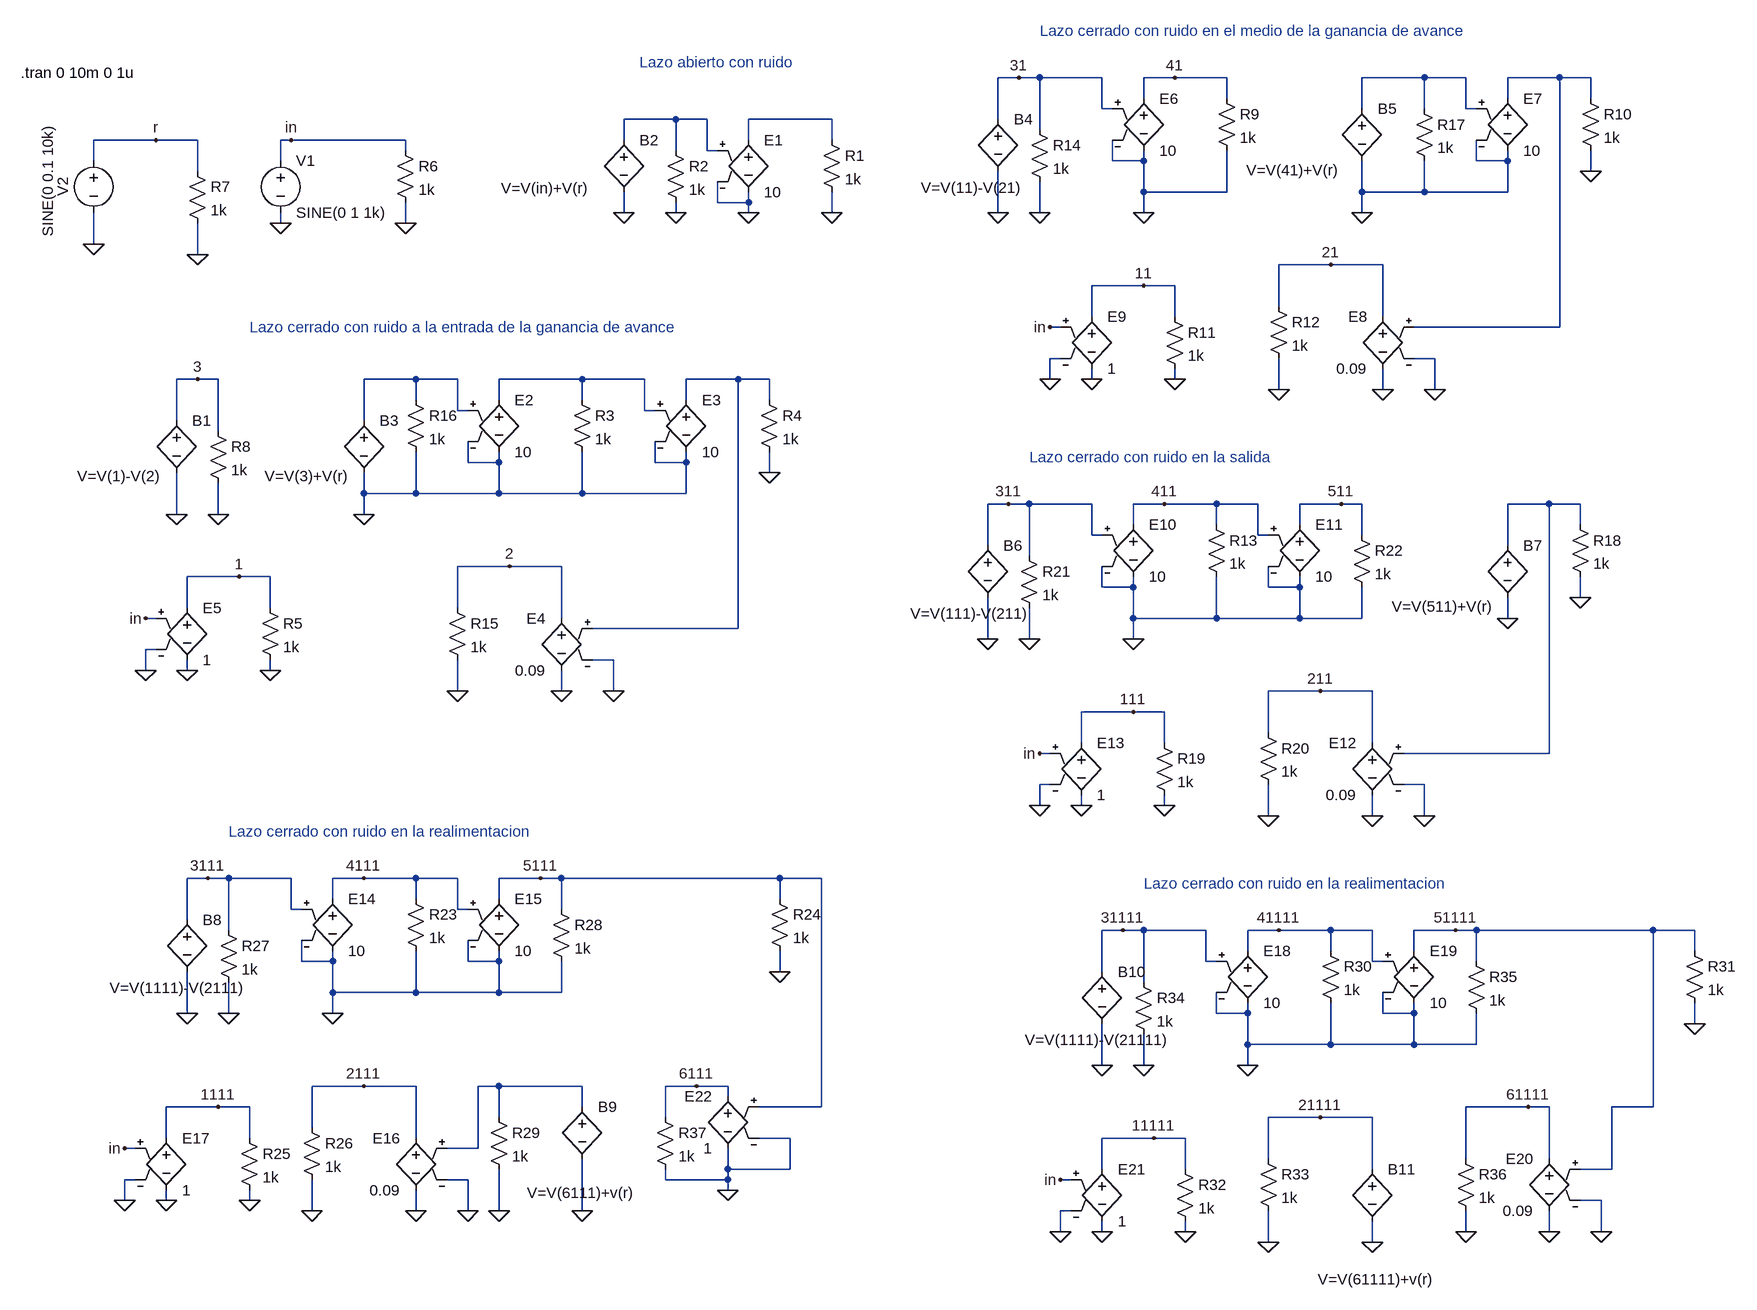
[diagram p0: schematic perturbaciones2.asc]
perturbaciones2.asc, the LTspice schematic file:
Version 4
SHEET 1 2744 1748
WIRE 720 -320 688 -320
WIRE 752 -320 720 -320
WIRE 848 -320 752 -320
WIRE 960 -320 912 -320
WIRE 1040 -320 960 -320
WIRE 1344 -320 1248 -320
WIRE 1408 -320 1344 -320
WIRE 1552 -320 1472 -320
WIRE 1600 -320 1552 -320
WIRE 912 -288 912 -320
WIRE 1040 -288 1040 -320
WIRE 1472 -288 1472 -320
WIRE 1600 -288 1600 -320
WIRE 848 -272 848 -320
WIRE 864 -272 848 -272
WIRE 1248 -272 1248 -320
WIRE 1344 -272 1344 -320
WIRE 1408 -272 1408 -320
WIRE 1424 -272 1408 -272
WIRE 192 -256 112 -256
WIRE 240 -256 192 -256
WIRE 432 -256 304 -256
WIRE 688 -256 688 -320
WIRE 752 -240 752 -320
WIRE -608 -224 -704 -224
WIRE -544 -224 -608 -224
WIRE -400 -224 -416 -224
WIRE -224 -224 -400 -224
WIRE 112 -224 112 -256
WIRE 304 -224 304 -256
WIRE 432 -224 432 -256
WIRE -224 -208 -224 -224
WIRE 192 -208 192 -256
WIRE 240 -208 240 -256
WIRE 256 -208 240 -208
WIRE -704 -192 -704 -224
WIRE -416 -192 -416 -224
WIRE 864 -192 864 -224
WIRE 912 -192 912 -208
WIRE 912 -192 864 -192
WIRE 1424 -192 1424 -224
WIRE 1472 -192 1472 -208
WIRE 1472 -192 1424 -192
WIRE -544 -176 -544 -224
WIRE 1600 -176 1600 -208
WIRE 912 -144 912 -192
WIRE 1040 -144 1040 -208
WIRE 1040 -144 912 -144
WIRE 1248 -144 1248 -192
WIRE 1344 -144 1344 -192
WIRE 1344 -144 1248 -144
WIRE 1472 -144 1472 -192
WIRE 1472 -144 1344 -144
WIRE 256 -128 256 -160
WIRE 304 -128 304 -144
WIRE 304 -128 256 -128
WIRE 112 -112 112 -144
WIRE 192 -112 192 -128
WIRE 304 -112 304 -128
WIRE 432 -112 432 -144
WIRE 688 -112 688 -176
WIRE 752 -112 752 -160
WIRE 912 -112 912 -144
WIRE 1248 -112 1248 -144
WIRE -416 -96 -416 -112
WIRE -224 -96 -224 -128
WIRE -704 -64 -704 -112
WIRE -544 -48 -544 -96
WIRE 1200 -32 1120 -32
WIRE 1280 -32 1200 -32
WIRE 912 0 832 0
WIRE 960 0 912 0
WIRE 1120 32 1120 -32
WIRE 832 48 832 0
WIRE 960 48 960 0
WIRE 1280 48 1280 -32
WIRE 784 64 768 64
WIRE 1552 64 1552 -320
WIRE 1552 64 1328 64
WIRE 784 112 768 112
WIRE 1360 112 1328 112
WIRE -544 144 -576 144
WIRE -512 144 -544 144
WIRE -208 144 -288 144
WIRE -144 144 -208 144
WIRE 48 144 -80 144
WIRE 144 144 48 144
WIRE 288 144 208 144
WIRE 336 144 288 144
WIRE 768 144 768 112
WIRE 832 144 832 128
WIRE 960 144 960 128
WIRE 1120 160 1120 112
WIRE 1280 160 1280 128
WIRE 1360 160 1360 112
WIRE -208 176 -208 144
WIRE -80 176 -80 144
WIRE 48 176 48 144
WIRE 208 176 208 144
WIRE 336 176 336 144
WIRE -144 192 -144 144
WIRE -128 192 -144 192
WIRE 144 192 144 144
WIRE 160 192 144 192
WIRE -576 208 -576 144
WIRE -288 208 -288 144
WIRE -512 224 -512 144
WIRE -128 272 -128 240
WIRE -80 272 -80 256
WIRE -80 272 -128 272
WIRE 160 272 160 240
WIRE 208 272 208 256
WIRE 208 272 160 272
WIRE 336 288 336 256
WIRE -288 320 -288 288
WIRE -208 320 -208 256
WIRE -208 320 -288 320
WIRE -80 320 -80 272
WIRE -80 320 -208 320
WIRE 48 320 48 256
WIRE 48 320 -80 320
WIRE 208 320 208 272
WIRE 208 320 48 320
WIRE 704 336 672 336
WIRE 736 336 704 336
WIRE 832 336 736 336
WIRE 944 336 896 336
WIRE 1024 336 944 336
WIRE 1088 336 1024 336
WIRE 1216 336 1152 336
WIRE 1248 336 1216 336
WIRE 1536 336 1472 336
WIRE 1584 336 1536 336
WIRE -576 352 -576 288
WIRE -512 352 -512 304
WIRE -288 352 -288 320
WIRE 896 368 896 336
WIRE 1024 368 1024 336
WIRE 1152 368 1152 336
WIRE 1584 368 1584 336
WIRE 832 384 832 336
WIRE 848 384 832 384
WIRE 1088 384 1088 336
WIRE 1104 384 1088 384
WIRE 1248 384 1248 336
WIRE 672 400 672 336
WIRE 1472 400 1472 336
WIRE 736 416 736 336
WIRE -64 432 -144 432
WIRE 16 432 -64 432
WIRE -480 448 -560 448
WIRE -432 448 -480 448
WIRE 848 464 848 432
WIRE 896 464 896 448
WIRE 896 464 848 464
WIRE 1104 464 1104 432
WIRE 1152 464 1152 448
WIRE 1152 464 1104 464
WIRE 1584 480 1584 448
WIRE -560 496 -560 448
WIRE -432 496 -432 448
WIRE -144 496 -144 432
WIRE -608 512 -624 512
WIRE 16 512 16 432
WIRE 896 512 896 464
WIRE 1024 512 1024 448
WIRE 1024 512 896 512
WIRE 1152 512 1152 464
WIRE 1152 512 1024 512
WIRE 1248 512 1248 464
WIRE 1248 512 1152 512
WIRE 1472 512 1472 480
WIRE 288 528 288 144
WIRE 288 528 64 528
WIRE 672 544 672 480
WIRE 736 544 736 496
WIRE 896 544 896 512
WIRE -608 560 -624 560
WIRE 96 576 64 576
WIRE -624 592 -624 560
WIRE -560 592 -560 576
WIRE -432 592 -432 576
WIRE -144 624 -144 576
WIRE 16 624 16 592
WIRE 96 624 96 576
WIRE 1184 624 1104 624
WIRE 1264 624 1184 624
WIRE 896 656 816 656
WIRE 944 656 896 656
WIRE 1104 688 1104 624
WIRE 816 704 816 656
WIRE 944 704 944 656
WIRE 1264 704 1264 624
WIRE 768 720 752 720
WIRE 1536 720 1536 336
WIRE 1536 720 1312 720
WIRE 768 768 752 768
WIRE 1344 768 1312 768
WIRE 752 800 752 768
WIRE 816 800 816 784
WIRE 944 800 944 784
WIRE 1104 816 1104 768
WIRE 1264 816 1264 784
WIRE 1344 816 1344 768
WIRE -528 912 -560 912
WIRE -496 912 -528 912
WIRE -400 912 -496 912
WIRE -288 912 -336 912
WIRE -208 912 -288 912
WIRE -144 912 -208 912
WIRE -16 912 -80 912
WIRE 16 912 -16 912
WIRE 352 912 16 912
WIRE 416 912 352 912
WIRE -336 944 -336 912
WIRE -208 944 -208 912
WIRE -80 944 -80 912
WIRE 352 944 352 912
WIRE -400 960 -400 912
WIRE -384 960 -400 960
WIRE -144 960 -144 912
WIRE -128 960 -144 960
WIRE 16 960 16 912
WIRE -560 976 -560 912
WIRE -496 992 -496 912
WIRE 880 992 848 992
WIRE 912 992 880 992
WIRE 1008 992 912 992
WIRE 1120 992 1072 992
WIRE 1200 992 1120 992
WIRE 1264 992 1200 992
WIRE 1392 992 1328 992
WIRE 1424 992 1392 992
WIRE 1696 992 1424 992
WIRE 1760 992 1696 992
WIRE 1072 1024 1072 992
WIRE 1200 1024 1200 992
WIRE 1328 1024 1328 992
WIRE 1760 1024 1760 992
WIRE -384 1040 -384 1008
WIRE -336 1040 -336 1024
WIRE -336 1040 -384 1040
WIRE -128 1040 -128 1008
WIRE -80 1040 -80 1024
WIRE -80 1040 -128 1040
WIRE 1008 1040 1008 992
WIRE 1024 1040 1008 1040
WIRE 1264 1040 1264 992
WIRE 1280 1040 1264 1040
WIRE 1424 1040 1424 992
WIRE 352 1056 352 1024
WIRE 848 1056 848 992
WIRE 912 1072 912 992
WIRE -336 1088 -336 1040
WIRE -208 1088 -208 1024
WIRE -208 1088 -336 1088
WIRE -80 1088 -80 1040
WIRE -80 1088 -208 1088
WIRE 16 1088 16 1040
WIRE 16 1088 -80 1088
WIRE -560 1120 -560 1056
WIRE -496 1120 -496 1072
WIRE -336 1120 -336 1088
WIRE 1024 1120 1024 1088
WIRE 1072 1120 1072 1104
WIRE 1072 1120 1024 1120
WIRE 1280 1120 1280 1088
WIRE 1328 1120 1328 1104
WIRE 1328 1120 1280 1120
WIRE 1760 1136 1760 1104
WIRE 1072 1168 1072 1120
WIRE 1200 1168 1200 1104
WIRE 1200 1168 1072 1168
WIRE 1328 1168 1328 1120
WIRE 1328 1168 1200 1168
WIRE 1424 1168 1424 1120
WIRE 1424 1168 1328 1168
WIRE 848 1200 848 1136
WIRE 912 1200 912 1152
WIRE 1072 1200 1072 1168
WIRE -288 1232 -368 1232
WIRE -208 1232 -288 1232
WIRE -80 1232 -112 1232
WIRE 48 1232 -80 1232
WIRE 224 1232 176 1232
WIRE 272 1232 224 1232
WIRE 272 1248 272 1232
WIRE -512 1264 -592 1264
WIRE -464 1264 -512 1264
WIRE 48 1264 48 1232
WIRE 416 1264 416 912
WIRE 416 1264 320 1264
WIRE 1504 1264 1408 1264
WIRE 1536 1264 1504 1264
WIRE 1696 1264 1696 992
WIRE 1696 1264 1632 1264
WIRE -80 1280 -80 1232
WIRE 176 1280 176 1232
WIRE 1184 1280 1104 1280
WIRE 1264 1280 1184 1280
WIRE -368 1296 -368 1232
WIRE -592 1312 -592 1264
WIRE -464 1312 -464 1264
WIRE -208 1312 -208 1232
WIRE 368 1312 320 1312
WIRE 928 1312 848 1312
WIRE 976 1312 928 1312
WIRE -640 1328 -656 1328
WIRE -112 1328 -112 1232
WIRE -112 1328 -160 1328
WIRE 1104 1344 1104 1280
WIRE 1408 1344 1408 1264
WIRE 1536 1344 1536 1264
WIRE 272 1360 272 1328
WIRE 368 1360 368 1312
WIRE 368 1360 272 1360
WIRE 848 1360 848 1312
WIRE 976 1360 976 1312
WIRE 1264 1360 1264 1280
WIRE 1632 1360 1632 1264
WIRE 1632 1360 1584 1360
WIRE -640 1376 -656 1376
WIRE -128 1376 -160 1376
WIRE 176 1376 176 1360
WIRE 272 1376 272 1360
WIRE 272 1376 176 1376
WIRE 800 1376 784 1376
WIRE 272 1392 272 1376
WIRE -656 1408 -656 1376
WIRE -592 1408 -592 1392
WIRE -464 1408 -464 1392
WIRE 1616 1408 1584 1408
WIRE -368 1424 -368 1376
WIRE -208 1424 -208 1392
WIRE -128 1424 -128 1376
WIRE -80 1424 -80 1360
WIRE 48 1424 48 1344
WIRE 800 1424 784 1424
WIRE 784 1456 784 1424
WIRE 848 1456 848 1440
WIRE 976 1456 976 1440
WIRE 1408 1456 1408 1424
WIRE 1536 1456 1536 1424
WIRE 1616 1456 1616 1408
WIRE 1104 1472 1104 1424
WIRE 1264 1472 1264 1440
FLAG 304 -112 0
FLAG 432 -112 0
FLAG -416 -96 0
FLAG 192 -112 0
FLAG 336 288 0
FLAG 16 624 0
FLAG 96 624 0
FLAG -400 -224 in
FLAG -560 592 0
FLAG -624 592 0
FLAG -624 512 in
FLAG -432 592 0
FLAG -480 448 1
FLAG -64 432 2
FLAG -144 624 0
FLAG -576 352 0
FLAG -224 -96 0
FLAG -704 -64 0
FLAG -544 -48 0
FLAG -608 -224 r
FLAG 112 -112 0
FLAG -512 352 0
FLAG -544 144 3
FLAG -288 352 0
FLAG 1600 -176 0
FLAG 1280 160 0
FLAG 1360 160 0
FLAG 832 144 0
FLAG 768 144 0
FLAG 768 64 in
FLAG 960 144 0
FLAG 912 0 11
FLAG 1200 -32 21
FLAG 1120 160 0
FLAG 688 -112 0
FLAG 752 -112 0
FLAG 720 -320 31
FLAG 912 -112 0
FLAG 1248 -112 0
FLAG 960 -320 41
FLAG 1584 480 0
FLAG 1264 816 0
FLAG 1344 816 0
FLAG 816 800 0
FLAG 752 800 0
FLAG 752 720 in
FLAG 944 800 0
FLAG 896 656 111
FLAG 1184 624 211
FLAG 1104 816 0
FLAG 672 544 0
FLAG 736 544 0
FLAG 704 336 311
FLAG 896 544 0
FLAG 944 336 411
FLAG 1216 336 511
FLAG 1472 512 0
FLAG 352 1056 0
FLAG -208 1424 0
FLAG -128 1424 0
FLAG -592 1408 0
FLAG -656 1408 0
FLAG -656 1328 in
FLAG -464 1408 0
FLAG -512 1264 1111
FLAG -288 1232 2111
FLAG -368 1424 0
FLAG -560 1120 0
FLAG -496 1120 0
FLAG -528 912 3111
FLAG -336 1120 0
FLAG -288 912 4111
FLAG -16 912 5111
FLAG -80 1424 0
FLAG 48 1424 0
FLAG 1760 1136 0
FLAG 1536 1456 0
FLAG 1616 1456 0
FLAG 848 1456 0
FLAG 784 1456 0
FLAG 784 1376 in
FLAG 976 1456 0
FLAG 928 1312 11111
FLAG 1184 1280 21111
FLAG 1104 1472 0
FLAG 848 1200 0
FLAG 912 1200 0
FLAG 880 992 31111
FLAG 1072 1200 0
FLAG 1120 992 41111
FLAG 1392 992 51111
FLAG 1264 1472 0
FLAG 1408 1456 0
FLAG 1504 1264 61111
FLAG 272 1392 0
FLAG 224 1232 6111
SYMBOL e 304 -240 R0
SYMATTR InstName E1
SYMATTR Value 10
SYMBOL res 416 -240 R0
SYMATTR InstName R1
SYMATTR Value 1k
SYMBOL voltage -416 -208 R0
WINDOW 123 0 0 Left 0
WINDOW 39 0 0 Left 0
SYMATTR InstName V1
SYMATTR Value SINE(0 1 1k)
SYMBOL voltage -704 -208 R0
WINDOW 0 -32 56 VBottom 2
WINDOW 3 -86 47 VTop 2
WINDOW 123 0 0 Left 0
WINDOW 39 0 0 Left 0
SYMATTR InstName V2
SYMATTR Value SINE(0 0.1 10k)
SYMBOL res 176 -224 R0
SYMATTR InstName R2
SYMATTR Value 1k
SYMBOL e -80 160 R0
SYMATTR InstName E2
SYMATTR Value 10
SYMBOL res 32 160 R0
SYMATTR InstName R3
SYMATTR Value 1k
SYMBOL e 208 160 R0
SYMATTR InstName E3
SYMATTR Value 10
SYMBOL res 320 160 R0
SYMATTR InstName R4
SYMATTR Value 1k
SYMBOL e 16 496 M0
SYMATTR InstName E4
SYMATTR Value 0.09
SYMBOL e -560 480 R0
SYMATTR InstName E5
SYMATTR Value 1
SYMBOL res -448 480 R0
SYMATTR InstName R5
SYMATTR Value 1k
SYMBOL bv -576 192 R0
WINDOW 3 -153 101 Left 2
SYMATTR InstName B1
SYMATTR Value V=V(1)-V(2)
SYMBOL res -160 480 R0
SYMATTR InstName R15
SYMATTR Value 1k
SYMBOL res -224 160 R0
SYMATTR InstName R16
SYMATTR Value 1k
SYMBOL res -240 -224 R0
SYMATTR InstName R6
SYMATTR Value 1k
SYMBOL bv 112 -240 R0
WINDOW 3 -189 90 Left 2
SYMATTR InstName B2
SYMATTR Value V=V(in)+V(r)
SYMBOL res -560 -192 R0
SYMATTR InstName R7
SYMATTR Value 1k
SYMBOL bv -288 192 R0
WINDOW 3 -153 101 Left 2
SYMATTR InstName B3
SYMATTR Value V=V(3)+V(r)
SYMBOL res -528 208 R0
SYMATTR InstName R8
SYMATTR Value 1k
SYMBOL e 912 -304 R0
SYMATTR InstName E6
SYMATTR Value 10
SYMBOL res 1024 -304 R0
SYMATTR InstName R9
SYMATTR Value 1k
SYMBOL e 1472 -304 R0
SYMATTR InstName E7
SYMATTR Value 10
SYMBOL res 1584 -304 R0
SYMATTR InstName R10
SYMATTR Value 1k
SYMBOL e 1280 32 M0
SYMATTR InstName E8
SYMATTR Value 0.09
SYMBOL e 832 32 R0
SYMATTR InstName E9
SYMATTR Value 1
SYMBOL res 944 32 R0
SYMATTR InstName R11
SYMATTR Value 1k
SYMBOL bv 688 -272 R0
WINDOW 3 -119 121 Left 2
SYMATTR InstName B4
SYMATTR Value V=V(11)-V(21)
SYMBOL res 1104 16 R0
SYMATTR InstName R12
SYMATTR Value 1k
SYMBOL bv 1248 -288 R0
WINDOW 3 -178 110 Left 2
SYMATTR InstName B5
SYMATTR Value V=V(41)+V(r)
SYMBOL res 736 -256 R0
SYMATTR InstName R14
SYMATTR Value 1k
SYMBOL res 1328 -288 R0
SYMATTR InstName R17
SYMATTR Value 1k
SYMBOL e 896 352 R0
SYMATTR InstName E10
SYMATTR Value 10
SYMBOL res 1008 352 R0
SYMATTR InstName R13
SYMATTR Value 1k
SYMBOL e 1152 352 R0
SYMATTR InstName E11
SYMATTR Value 10
SYMBOL res 1568 352 R0
SYMATTR InstName R18
SYMATTR Value 1k
SYMBOL e 1264 688 M0
SYMATTR InstName E12
SYMATTR Value 0.09
SYMBOL e 816 688 R0
SYMATTR InstName E13
SYMATTR Value 1
SYMBOL res 928 688 R0
SYMATTR InstName R19
SYMATTR Value 1k
SYMBOL bv 672 384 R0
WINDOW 3 -119 121 Left 2
SYMATTR InstName B6
SYMATTR Value V=V(111)-V(211)
SYMBOL res 1088 672 R0
SYMATTR InstName R20
SYMATTR Value 1k
SYMBOL bv 1472 384 R0
WINDOW 3 -178 110 Left 2
SYMATTR InstName B7
SYMATTR Value V=V(511)+V(r)
SYMBOL res 720 400 R0
SYMATTR InstName R21
SYMATTR Value 1k
SYMBOL res 1232 368 R0
SYMATTR InstName R22
SYMATTR Value 1k
SYMBOL e -336 928 R0
SYMATTR InstName E14
SYMATTR Value 10
SYMBOL res -224 928 R0
SYMATTR InstName R23
SYMATTR Value 1k
SYMBOL e -80 928 R0
SYMATTR InstName E15
SYMATTR Value 10
SYMBOL res 336 928 R0
SYMATTR InstName R24
SYMATTR Value 1k
SYMBOL e -208 1296 M0
SYMATTR InstName E16
SYMATTR Value 0.09
SYMBOL e -592 1296 R0
SYMATTR InstName E17
SYMATTR Value 1
SYMBOL res -480 1296 R0
SYMATTR InstName R25
SYMATTR Value 1k
SYMBOL bv -560 960 R0
WINDOW 3 -119 121 Left 2
SYMATTR InstName B8
SYMATTR Value V=V(1111)-V(2111)
SYMBOL res -384 1280 R0
SYMATTR InstName R26
SYMATTR Value 1k
SYMBOL bv 48 1248 R0
WINDOW 3 -85 148 Left 2
SYMATTR InstName B9
SYMATTR Value V=V(6111)+v(r)
SYMBOL res -512 976 R0
SYMATTR InstName R27
SYMATTR Value 1k
SYMBOL res 0 944 R0
SYMATTR InstName R28
SYMATTR Value 1k
SYMBOL res -96 1264 R0
SYMATTR InstName R29
SYMATTR Value 1k
SYMBOL e 1072 1008 R0
SYMATTR InstName E18
SYMATTR Value 10
SYMBOL res 1184 1008 R0
SYMATTR InstName R30
SYMATTR Value 1k
SYMBOL e 1328 1008 R0
SYMATTR InstName E19
SYMATTR Value 10
SYMBOL res 1744 1008 R0
SYMATTR InstName R31
SYMATTR Value 1k
SYMBOL e 1536 1328 M0
SYMATTR InstName E20
SYMATTR Value 0.09
SYMBOL e 848 1344 R0
SYMATTR InstName E21
SYMATTR Value 1
SYMBOL res 960 1344 R0
SYMATTR InstName R32
SYMATTR Value 1k
SYMBOL bv 848 1040 R0
WINDOW 3 -119 121 Left 2
SYMATTR InstName B10
SYMATTR Value V=V(1111)-V(21111)
SYMBOL res 1088 1328 R0
SYMATTR InstName R33
SYMATTR Value 1k
SYMBOL bv 1264 1344 R0
WINDOW 3 -84 185 Left 2
SYMATTR InstName B11
SYMATTR Value V=V(61111)+v(r)
SYMBOL res 896 1056 R0
SYMATTR InstName R34
SYMATTR Value 1k
SYMBOL res 1408 1024 R0
SYMATTR InstName R35
SYMATTR Value 1k
SYMBOL res 1392 1328 R0
SYMATTR InstName R36
SYMATTR Value 1k
SYMBOL e 272 1232 M0
SYMATTR InstName E22
SYMATTR Value 1
SYMBOL res 160 1264 R0
SYMATTR InstName R37
SYMATTR Value 1k
TEXT -816 -328 Left 2 !.tran 0 10m 0 1u
TEXT 136 -344 Left 2 ;Lazo abierto con ruido
TEXT -464 64 Left 2 ;Lazo cerrado con ruido a la entrada de la ganancia de avance
TEXT 752 -392 Left 2 ;Lazo cerrado con ruido en el medio de la ganancia de avance
TEXT 736 264 Left 2 ;Lazo cerrado con ruido en la salida
TEXT -496 840 Left 2 ;Lazo cerrado con ruido en la realimentacion
TEXT 912 920 Left 2 ;Lazo cerrado con ruido en la realimentacion

The netlist it stands for:
* perturbaciones2.asc
E1 N004 0 N003 0 10
R1 N004 0 1k
V1 in 0 SINE(0 1 1k)
V2 r 0 SINE(0 0.1 10k)
R2 N003 0 1k
E2 N006 0 N005 0 10
R3 N006 0 1k
E3 N007 0 N006 0 10
R4 N007 0 1k
E4 2 0 N007 0 0.09
E5 1 0 in 0 1
R5 1 0 1k
B1 3 0 V=V(1)-V(2)
R15 2 0 1k
R16 N005 0 1k
R6 in 0 1k
B2 N003 0 V=V(in)+V(r)
R7 r 0 1k
B3 N005 0 V=V(3)+V(r)
R8 3 0 1k
E6 41 0 31 0 10
R9 41 0 1k
E7 N002 0 N001 0 10
R10 N002 0 1k
E8 21 0 N002 0 0.09
E9 11 0 in 0 1
R11 11 0 1k
B4 31 0 V=V(11)-V(21)
R12 21 0 1k
B5 N001 0 V=V(41)+V(r)
R14 31 0 1k
R17 N001 0 1k
E10 411 0 311 0 10
R13 411 0 1k
E11 511 0 411 0 10
R18 N008 0 1k
E12 211 0 N008 0 0.09
E13 111 0 in 0 1
R19 111 0 1k
B6 311 0 V=V(111)-V(211)
R20 211 0 1k
B7 N008 0 V=V(511)+V(r)
R21 311 0 1k
R22 511 0 1k
E14 4111 0 3111 0 10
R23 4111 0 1k
E15 5111 0 4111 0 10
R24 5111 0 1k
E16 2111 0 N009 0 0.09
E17 1111 0 in 0 1
R25 1111 0 1k
B8 3111 0 V=V(1111)-V(2111)
R26 2111 0 1k
B9 N009 0 V=V(6111)+v(r)
R27 3111 0 1k
R28 5111 0 1k
R29 N009 0 1k
E18 41111 0 31111 0 10
R30 41111 0 1k
E19 51111 0 41111 0 10
R31 51111 0 1k
E20 61111 0 51111 0 0.09
E21 11111 0 in 0 1
R32 11111 0 1k
B10 31111 0 V=V(1111)-V(21111)
R33 21111 0 1k
B11 21111 0 V=V(61111)+v(r)
R34 31111 0 1k
R35 51111 0 1k
R36 61111 0 1k
E22 6111 0 5111 0 1
R37 6111 0 1k
.tran 0 10m 0 1u
* Lazo abierto con ruido
* Lazo cerrado con ruido a la entrada de la ganancia de avance
* Lazo cerrado con ruido en el medio de la ganancia de avance
* Lazo cerrado con ruido en la salida
* Lazo cerrado con ruido en la realimentacion
* Lazo cerrado con ruido en la realimentacion
.backanno
.end